# Altium schematic sheet boost.SchDoc
size A4
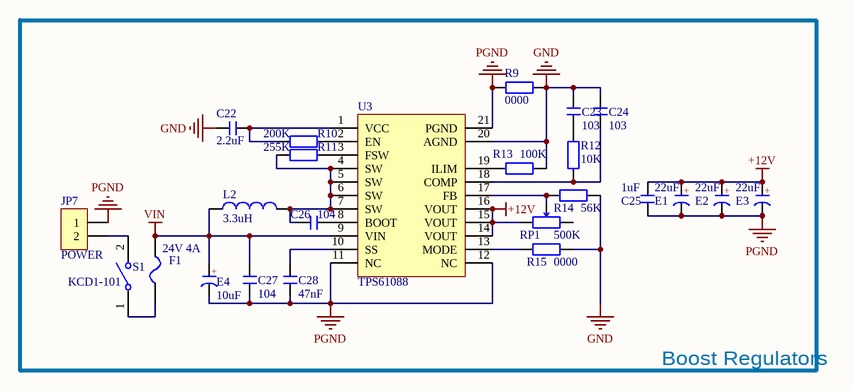
[diagram p0: boost.SchDoc]

## Parts
C22  2.2uF  [C 0603_L]
C23  103  [C 0603_L]
C24  103  [C 0603_L]
C25  1uF  [C 0603_L]
C26  104  [C 0603_L]
C27  104  [C 0603_L]
C28  47nF  [C 0603_L]
E1  22uF  [CD A(3216)]
E2  22uF  [CD A(3216)]
E3  22uF  [CD A(3216)]
E4  10uF  [CD A(3216)]
F1  24V 4A  [FU 1206]
JP7  POWER  [KF301-5.0-2P]
L2  3.3uH  [CDRH127]
R9  0000  [R 0603_L]
R10  200K  [R 0603_L]
R11  255K  [R 0603_L]
R12  10K  [R 0603_L]
R13  100K  [R 0603_L]
R14  56K  [R 0603_L]
R15  0000  [R 0603_L]
RP1  500K  [3296W]
S1  KCD1-101  [KCD1-101]
U3  TPS61088  [S-PVQFN-N20]

## Blocks framed on the sheet
Boost Regulators: C22-C28 E1-E4 F1 JP7 L2 R9-R15 RP1 S1 U3

## Nets
+12V: C25.2 E1.1(A) E2.1(A) E3.1(A) RP1.1 U3.14(VOUT) U3.15(VOUT) U3.16(VOUT)
GND: C22.2 C23.2 C24.2 R9.2 R13.2 R14.1 R15.2 U3.20(AGND)
PGND: C25.1 C27.1 C28.1 E1.2(K) E2.2(K) E3.2(K) E4.2(K) JP7.1 R9.1 U3.11(NC) U3.12(NC) U3.21(PGND)
VIN: C27.2 E4.1(A) F1.2 L2.1 U3.9(VIN)
NetC22_1: C22.1 R10.2 U3.1(VCC)
NetC23_1: C23.1 R12.2
NetC24_1: C24.1 R12.1 U3.18(COMP)
NetC26_1: C26.1 U3.8(BOOT)
NetC26_2: C26.2 L2.2 R11.2 U3.4(SW) U3.5(SW) U3.6(SW) U3.7(SW)
NetC28_2: C28.2 U3.10(SS)
NetF1_1: F1.1 S1.1
NetJP7_2: JP7.2 S1.2
NetR10_1: R10.1 U3.2(EN)
NetR11_1: R11.1 U3.3(FSW)
NetR13_1: R13.1 U3.19(ILIM)
NetR14_2: R14.2 RP1.2 U3.17(FB)
NetR15_1: R15.1 U3.13(MODE)

Not connected (* = marked no-connect by the designer): RP1 3

## Notes on the sheet
- (in symbol C-CD) +

## Library data of the parts
C22-C28 = C: 无极性贴片电容; 版权归属: 源创客; BOM名称: 无极性贴片电容; 学习资源: www.ooocke.com
E1-E4 = C-CD: 贴片钽电容; 版权归属: 源创客; BOM名称: 贴片钽电容; 学习资源: www.ooocke.com
F1 = FU: 贴片保险丝; 版权归属: 源创客; BOM名称: 贴片保险丝; 学习资源: www.ooocke.com
JP7 = Header 2: 2P接插件; 版权归属: 源创客; BOM名称: 2P接插件; 学习资源: www.ooocke.com
L2 = Inductor: Code_IEC: 1005; Published: 8-Jun-2000; LatestRevisionDate: 29-May-2009; LatestRevisionNote: IPC-7351 Footprint Added.; PackageReference: 0402-A; Publisher: Altium Limited; PackageDescription: Chip Inductor; Code_JEITA: 0402; Value: 3.3uH
R9-R15 = R: 贴片电阻; 版权归属: 源创客; BOM名称: 贴片电阻; 学习资源: www.ooocke.com
RP1 = RP-ID: 插件单联电位器; BOM名称: 插件电位器; 版权归属: 源创客; 学习资源: www.ooocke.com
S1 = KCD1-101: 1路单刀船型开关; 版权归属: 源创客; BOM名称: 1路单刀船型开关; 学习资源: www.ooocke.com